# EAGLE design RFM69%20USB%20Gateway (EAGLE 7.6.0)
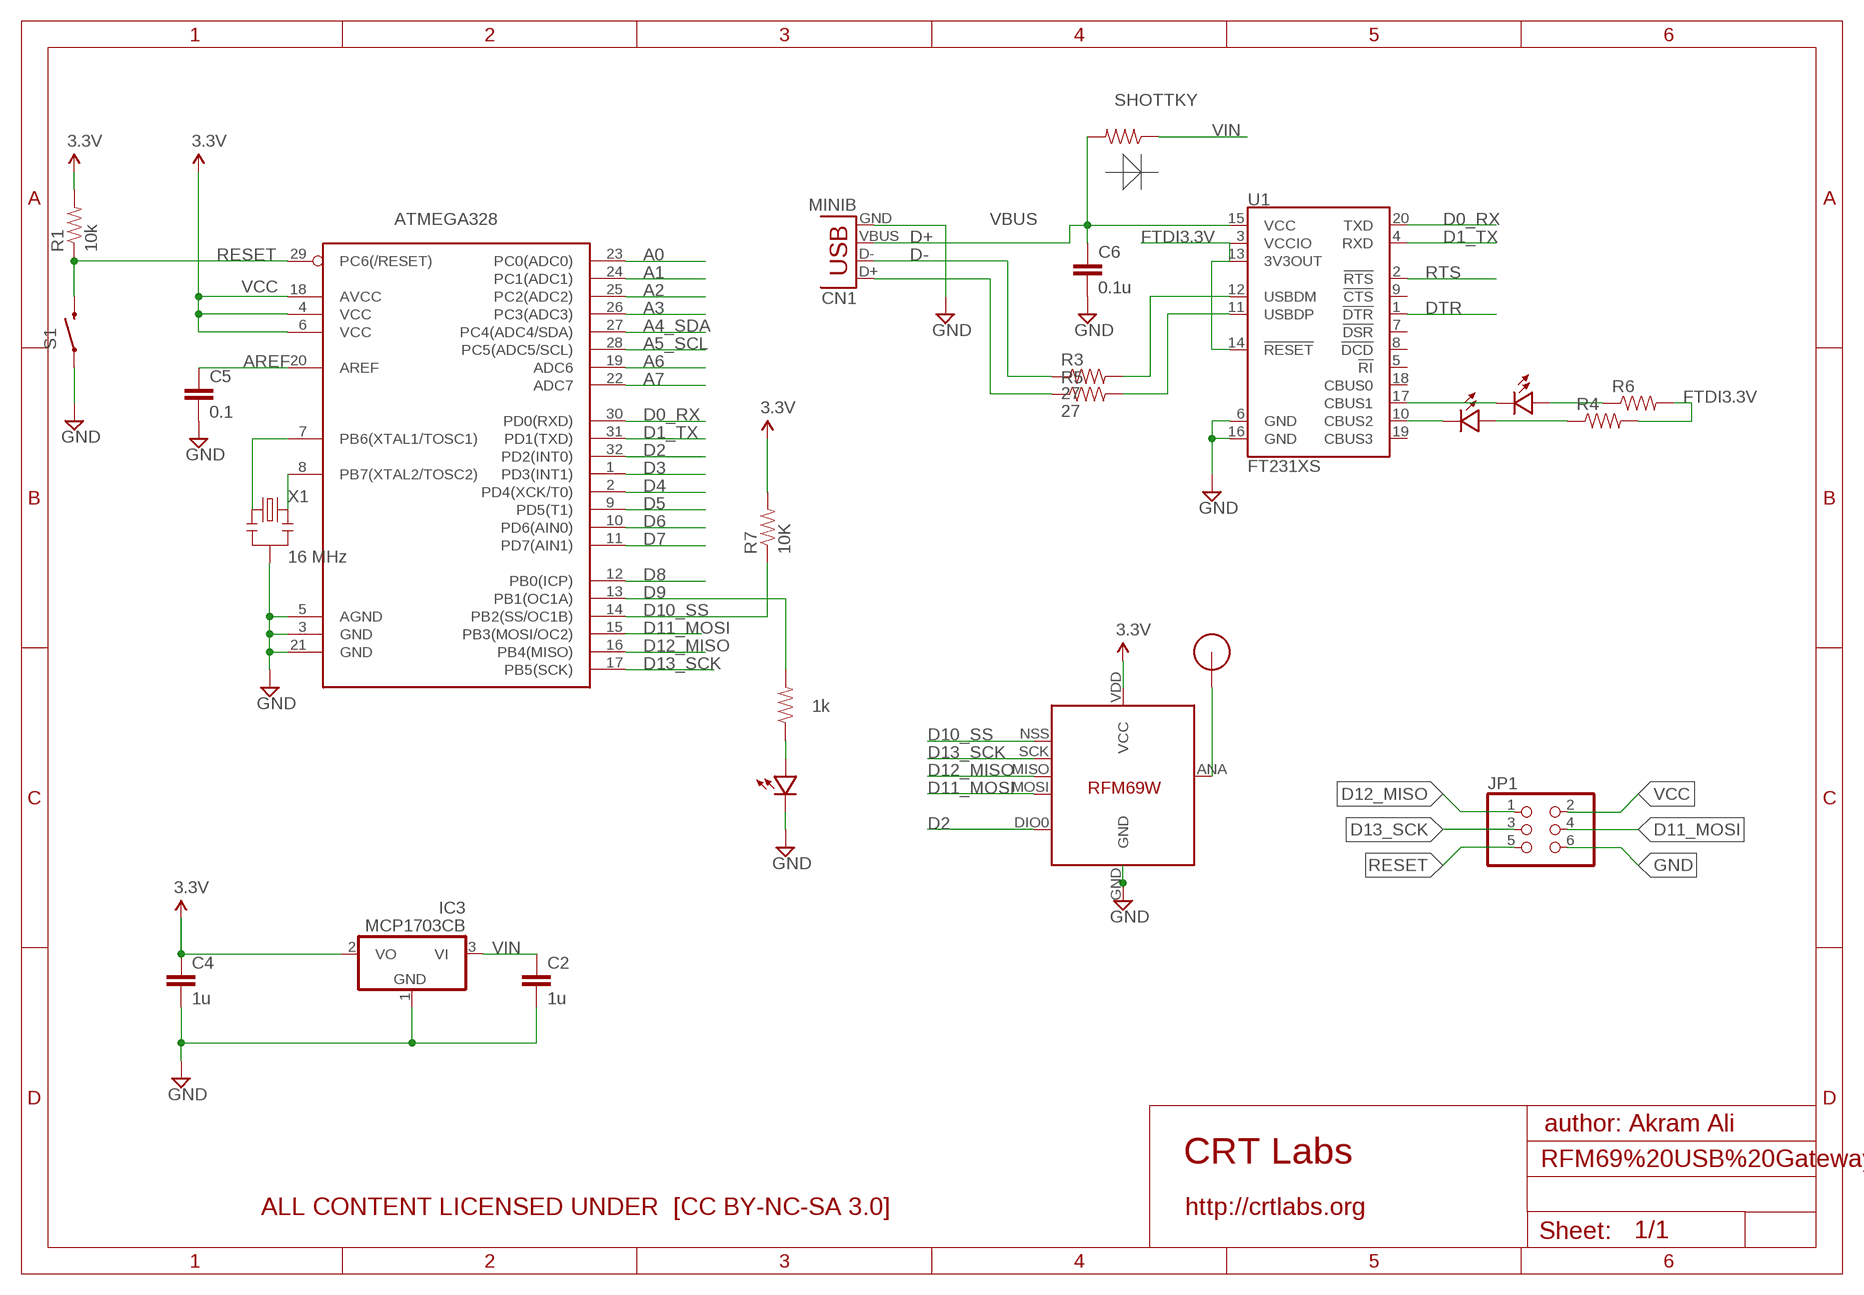
[diagram p0: schematic, sheet 1]

## Parts
ATMEGA328  ATMega-328  ATMEGA168/328TQFP32  [TQFP32-08]
C2  1u  CAP0805  [0805]
C4  1u  CAP0805  [0805]
C5  0.1  CAP0805  [0805]
C6  0.1u  CAP0805  [0805]
CN1  MINIB  USB-A-H  [USB-A-H]
D  SHOTTKY  RESISTOR0805  [0805]
IC3  MCP1703CB  [SOT23]
JP1  PINHD-2X3  [2X03]
R1  10k  RESISTOR0805  [0805]
R2  1k  RESISTOR0805-RES  [0805]
R3  27  RESISTOR0805-RES  [0805]
R4  RESISTOR0805-RES  [0805]
R5  27  RESISTOR0805-RES  [0805]
R6  RESISTOR0805-RES  [0805]
R7  10K  RESISTOR0805-RES  [0805]
S1  SWITCH-MOMENTARY-2SMD-ALT01  [TACTILE-SWITCH-SMD-ALT01]
U1  FT231XS  [SSOP20_L]
U$1  RFM12B_ANTENNA  [RFM12B-ANTENNA]
U$2  LED0805  [0805-LED]
U$4  LED0805  [0805-LED]
U$5  RFM69  [RFM69W-MINPADS]
U$7  LED0805  [0805-LED]
X1  16 MHz  RESONATORSMD  [RESONATOR-SMD]

## Nets
A0: ATMEGA328.23(PC0(ADC0))
A1: ATMEGA328.24(PC1(ADC1))
A2: ATMEGA328.25(PC2(ADC2))
A3: ATMEGA328.26(PC3(ADC3))
A4_SDA: ATMEGA328.27(PC4(ADC4/SDA))
A5_SCL: ATMEGA328.28(PC5(ADC5/SCL))
A6: ATMEGA328.19(ADC6)
A7: ATMEGA328.22(ADC7)
AREF: ATMEGA328.20(AREF) C5.1
D0_RX: ATMEGA328.30(PD0(RXD)) U1.20(TXD)
D1_TX: ATMEGA328.31(PD1(TXD)) U1.4(RXD)
D2: ATMEGA328.32(PD2(INT0)) U$5.DIO0
D3: ATMEGA328.1(PD3(INT1))
D4: ATMEGA328.2(PD4(XCK/T0))
D5: ATMEGA328.9(PD5(T1))
D6: ATMEGA328.10(PD6(AIN0))
D7: ATMEGA328.11(PD7(AIN1))
D8: ATMEGA328.12(PB0(ICP))
D9: ATMEGA328.13(PB1(OC1A)) R2.2
D10_SS: ATMEGA328.14(PB2(SS/OC1B)) R7.1 U$5.NSS(SEL)
D11_MOSI: ATMEGA328.15(PB3(MOSI/OC2)) JP1.4 U$5.MOSI
D12_MISO: ATMEGA328.16(PB4(MISO)) JP1.1 U$5.MISO
D13_SCK: ATMEGA328.17(PB5(SCK)) JP1.3 U$5.SCK
D+: CN1.D+ R5.1
D-: CN1.D- R3.1
DTR: U1.1(!DTR)
FTDI3.3V: R4.2 R6.2 U1.3(VCCIO) U1.13(3V3OUT) U1.14(!RESET)
GND [power]: ATMEGA328.3(GND) ATMEGA328.5(AGND) ATMEGA328.21(GND) C2.2 C4.2 C5.2 C6.2 CN1.GND IC3.1(GND) JP1.6 S1.1 S1.2 U1.6(GND) U1.16(GND) U$2.MINUS U$5.GND X1.2
N$1: ATMEGA328.7(PB6(XTAL1/TOSC1)) X1.1
N$2: R2.1 U$2.PLUS
N$3: U$1.P$1 U$5.ANA(ANT)
N$4: R3.2 U1.12(USBDM)
N$5: R5.2 U1.11(USBDP)
N$6: U1.17(CBUS1) U$4.MINUS
N$7: U1.10(CBUS2) U$7.MINUS
N$8: R4.1 U$7.PLUS
N$9: R6.1 U$4.PLUS
N$21: ATMEGA328.8(PB7(XTAL2/TOSC2)) X1.3
RESET: ATMEGA328.29(PC6(/RESET)) JP1.5 R1.1 S1.3 S1.4
RTS: U1.2(!RTS)
VBUS [power]: C6.1 CN1.VBUS D.2 U1.15(VCC)
VCC: ATMEGA328.4(VCC) ATMEGA328.6(VCC) ATMEGA328.18(AVCC) C4.1 IC3.2(VO) JP1.2 R1.2 R7.2 U$5.VDD(VCC) ; supply symbol labelled 3.3V
VIN: C2.1 D.1 IC3.3(VI)
Unconnected: U1.5(!RI) U1.7(!DSR) U1.8(!DCD) U1.9(!CTS) U1.18(CBUS0) U1.19(CBUS3)

## Notes on the sheet
- author: Akram Ali
- CRT Labs
- ALL CONTENT LICENSED UNDER  [CC BY-NC-SA 3.0] | http://crtlabs.org

## Library data of the parts
ATMEGA328 = LowPowerLab:ATMEGA168/328: Atmel 32-pin 8-bit micro, 16k flash.
C2 C5 C6 = SparkFun:CAP: Capacitor Standard 0603 ceramic capacitor, and 0.1" leaded capacitor.
C4 = LowPowerLab:CAP: Capacitor Standard 0603 ceramic capacitor, and 0.1" leaded capacitor.
CN1 = SparkFun-Connectors:USB: USB Connectors USB-B-PTH is fully proven SKU : PRT-00139/CONN-08278 USB-miniB is fully proven SKU : PRT-00587 USB-A-PCB is untested. USB-A-H is throughly reviewed, but untested. Spark Fun Electronics SKU : PRT-00437 USB-B-SMT is throughly reviewed, but untested. Needs silkscreen touching up. USB-A-S has not been used/tested USB-MB-H has not been used/tested USB-MICROB has been used. CONN-09505; PROD_ID: CONN-08367
D R1 = LowPowerLab:RESISTOR: Resistor Basic schematic elements and footprints for 0603, 1206, and PTH resistors.
IC3 = linear:MCP1703: 250 mA, 16V, Low Quiescent Current LDO Regulator Source: http://ww1.microchip.com/downloads/en/DeviceDoc/22049b.pdf
JP1 = pinhead:PINHD-2X3: PIN HEADER
R2-R7 = SparkFun:RESISTOR: Resistor Basic schematic elements and footprints for 0603, 1206, and PTH resistors.
S1 = Testing:SWITCH-MOMENTARY-2: Various NO switches- pushbuttons, reed, etc
U1 = SparkFun-DigitalIC:FT231X: FTDI FT231X Full Speed USB to Full-handshake UART This USB2.0 Full Speed IC offers a compact bridge to full handshake UART interfaces. The device is a UART, capable of operating up to 3MBaud, with low power consumption (8mA). The FT231X includes the complete FT-X series feature set and enables USB to be added into a system design quickly and easily over a UART interface.; PROD_ID: IC-11524
U$1 = LowPowerLab:RFM12B_ANTENNA
U$2 U$4 U$7 = LowPowerLab:LED
U$5 = LowPowerLab:RFM69
X1 = SparkFun:RESONATOR: Resonator Small SMD resonator. This is the itty bitty 10/20MHz resonators with built in caps. CSTCE10M0G55 and CSTCE20M0V53. Footprint has been reviewed closely but hasn't been tested yet.

## Net classes
1 power: width 0.381 mm, clearance 0.254 mm

## Board
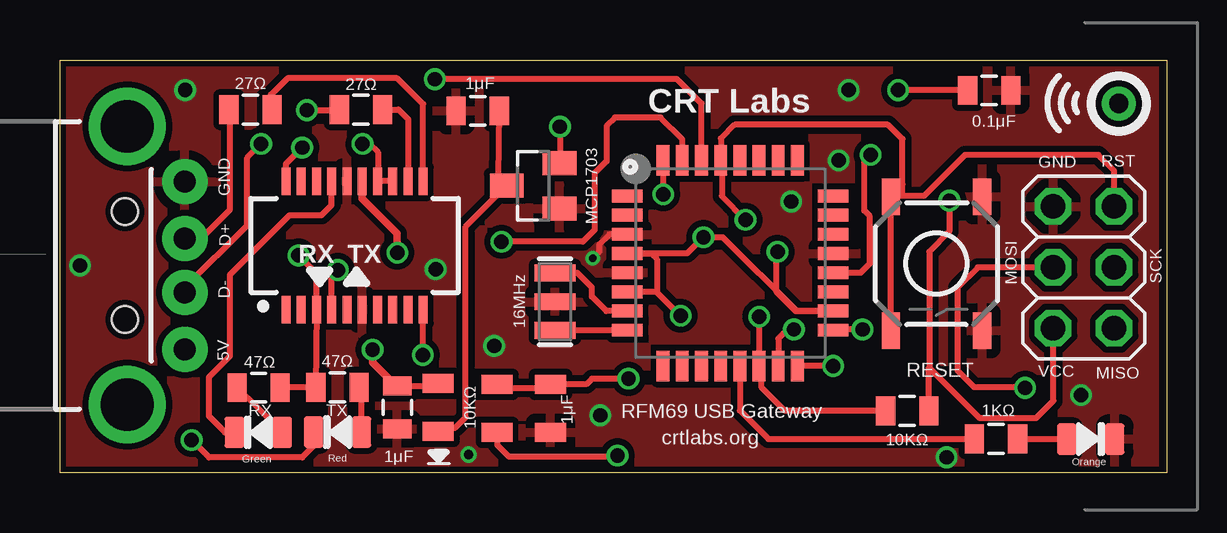
[diagram p1: board, top side]
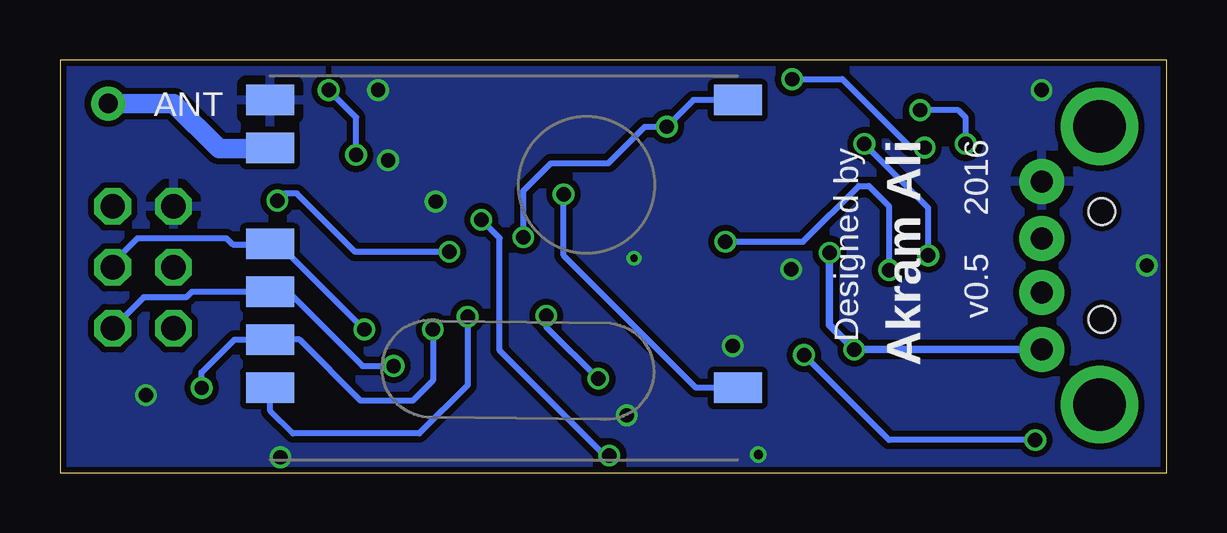
[diagram p2: board, bottom side, seen from below]

Size 46.14 x 17.22 mm. Coordinates in mm from the lower left corner, seen from the top.
Outline: 46.14,0 0,0 0,17.22 46.14,17.22 46.14,0
Copper layers (1*16): Top 0.035mm / dielectric 1.5mm / Bottom 0.035mm
Design rules "ITEADstudio_DRC *": minimum track width 6mil, minimum drill 12mil, track to track 6mil, track to pad 6mil, pad to pad 6mil, via to via 6mil, smd to smd 0mil, copper to edge 10mil, drill to drill 10mil, minimum pad ring 10mil, minimum via ring 6mil, stop-mask expansion 2mil, vias tented up to drill 100mil, thermal gap 15mil
tRestrict: area 6.5,12.3 to 7.4,12.8

### Footprints (pad centres in the part's own frame; a part is rotated, then mirrored left to right if it is on the bottom)
TQFP32-08 = smd 1.27 x 0.533: 1 -4.293,2.8; 2 -4.293,2; 3 -4.293,1.2; 4 -4.293,0.4; 5 -4.293,-0.4; 6 -4.293,-1.2; 7 -4.293,-2; 8 -4.293,-2.8; 17 4.293,-2.8; 18 4.293,-2; 19 4.293,-1.2; 20 4.293,-0.4; 21 4.293,0.4; 22 4.293,1.2; 23 4.293,2; 24 4.293,2.8 | smd 0.533 x 1.27: 9 -2.8,-4.293; 10 -2,-4.293; 11 -1.2,-4.293; 12 -0.4,-4.293; 13 0.4,-4.293; 14 1.2,-4.293; 15 2,-4.293; 16 2.8,-4.293; 25 2.8,4.293; 26 2,4.293; 27 1.2,4.293; 28 0.4,4.293; 29 -0.4,4.293; 30 -1.2,4.293; 31 -2,4.293; 32 -2.8,4.293
0805 = smd 0.8 x 1.2: 1 -0.9,0; 2 0.9,0
0805' = smd 0.8 x 1.3: 1 -1,0; 2 1,0
USB-A-H = drill 0.914 pad 1.88: D+ 2.4,1.127; D- 2.4,-1.127; GND 2.4,3.5; VBUS 2.4,-3.5 | drill 2.2: GND2 0,-5.8; GND3 0,5.8 | hole 1.1: -0.1,2.25; -0.1,-2.25
SOT23 = smd 1 x 1.4: 1 -0.95,-1.1; 2 0.95,-1.1; 3 0,1.1
2X03 = drill 1.016 octagon: 1 -2.54,-1.27; 2 -2.54,1.27; 3 0,-1.27; 4 0,1.27; 5 2.54,-1.27; 6 2.54,1.27
TACTILE-SWITCH-SMD-ALT01 = smd 1.524 x 0.762: 1 -2.794,1.905; 2 2.794,1.905; 3 -2.794,-1.905; 4 2.794,-1.905
SSOP20_L = smd 0.381 x 1.143: 1 -2.857,-2.68; 2 -2.223,-2.68; 3 -1.587,-2.68; 4 -0.953,-2.68; 5 -0.318,-2.68; 6 0.318,-2.68; 7 0.953,-2.68; 8 1.587,-2.68; 9 2.223,-2.68; 10 2.857,-2.68; 11 2.857,2.68; 12 2.223,2.68; 13 1.587,2.68; 14 0.953,2.68; 15 0.318,2.68; 16 -0.318,2.68; 17 -0.953,2.68; 18 -1.587,2.68; 19 -2.223,2.68; 20 -2.857,2.68
RFM12B-ANTENNA = drill 0.8 pad 1.422: P$1 0,0
0805-LED = smd 0.8 x 1.3: MINUS -1,0; PLUS 1,0
RFM69W-MINPADS = smd 2 x 1.27: ANA 8,-5; DIO0 -11.5,5; GND 8,-7; MISO 8,1; MOSI 8,3; NSS 8,5; SCK 8,-1; VDD -11.5,-7
RESONATOR-SMD = smd 0.7 x 1.7: 1 -1.2,0; 2 0,0; 3 1.2,0

### Placement (x,y rotation side)
ATMEGA328  27.94,8.75 0 top
C2  17.41,15.1 180 top
C4  1u  [0805']  20.45,2.69 270 top
C5  38.73,15.95 0 top
C6  14.06,2.73 270 top
CN1  2.81,8.65 0 top
D  SHOTTKY  [0805']  15.76,2.73 90 top
IC3  19.72,11.98 90 top
JP1  42.67,8.57 90 top
R1  10k  [0805']  18.22,2.69 90 top
R2  39.01,1.42 180 top
R3  12.55,15.15 0 top
R4  11.57,3.57 180 top
R5  7.94,15.15 0 top
R6  8.28,3.56 0 top
R7  35.32,2.59 0 top
S1  36.54,8.72 270 top
U1  12.28,9.49 0 top
U$1  44.13,15.41 0 top
U$2  42.96,1.41 180 top
U$4  8.27,1.69 0 top
U$5  29.39,8.55 180 bottom
U$7  11.57,1.7 0 top
X1  20.64,7.14 270 top

### Tracks (layer width: path | path; a pad name or v marks a point on that pad's centre or on a via)
AREF  (via drill 0.6 pad 0.3)
  Top 0.254: ATMEGA328.20 33.38,8.35 33.76,8.73 33.76,10.71 33.53,10.93 33.53,12.99 v33.8,13.26 | C5.1 34.95,15.95 v34.94,15.96
  Bottom 0.254: v34.94,15.96 33.8,14.82 v33.8,13.26
D0_RX  (via drill 0.6 pad 0.3)
  Top 0.254: U1.20 9.42,12.89 v10.1,13.56 | v15.62,16.42 25.72,16.42 26.74,15.4 ATMEGA328.30
  Bottom 0.254: v10.1,13.56 10.67,13.56 13.53,16.42 v15.62,16.42
D1_TX  (via drill 0.6 pad 0.3)
  Top 0.254: U1.4 11.33,8.2 v11.58,8.46 | ATMEGA328.31 25.94,13.91 25.03,14.82 23.13,14.82 22.78,14.48 22.78,12.99 22.29,12.5 22.29,10.13 21.79,9.64 v18.4,9.64
  Bottom 0.254: v18.4,9.64 15.16,9.64 12.84,11.96 12.42,11.96 11.58,11.13 v11.58,8.46
D2  (via drill 0.6 pad 0.3)
  Top 0.254: v25.15,11.62 ATMEGA328.32
  Bottom 0.254: 25.11,11.58 v25.15,11.62 25.15,9.07 19.63,3.55 U$5.DIO0
D9
  Top 0.254: ATMEGA328.13 28.34,2.6 29.53,1.41 38.15,1.41 R2.2
D10_SS  (via drill 0.6 pad 0.3)
  Top 0.254: v29.15,6.52 ATMEGA328.14 29.24,4.36 29.24,3.56 30.21,2.59 R7.1
  Bottom 0.254: v29.15,6.52 29.15,3.66 31.17,1.64 36.42,1.64 37.38,2.59 U$5.NSS
D11_MOSI  (via drill 0.6 pad 0.3)
  Top 0.254: v30.59,5.98 30.33,5.98 29.95,5.6 ATMEGA328.15 | JP1.4 38.25,8.57 37.41,7.73 37.41,4.27 38.1,3.58 40.2,3.58 v40.23,3.54
  Bottom 0.254: 30.56,5.94 v30.59,5.98 30.59,3.85 31.43,3.01 33.6,3.01 36.16,5.56 37.37,5.56 U$5.MOSI 37.4,5.56 38.86,5.56 40.23,4.19 v40.23,3.54
D12_MISO  (via drill 0.6 pad 0.3)
  Top 0.254: v32.23,4.46 ATMEGA328.16
  Bottom 0.254: v32.23,4.46 33.53,4.46 36.62,7.55 U$5.MISO 40.65,7.55 40.88,7.32 42.66,7.32 JP1.1
D13_SCK  (via drill 0.6 pad 0.3)
  Top 0.254: v33.45,5.98 32.26,5.98 ATMEGA328.17
  Bottom 0.254: JP1.3 43.94,8.75 42.9,9.79 39.21,9.79 38.94,9.53 37.41,9.53 U$5.SCK 37.02,9.55 v33.45,5.98
D+
  Top 0.254: CN1.D+ 5.89,9.78 7.09,10.97 7.09,15.15 R5.1
D-  (via drill 0.6 pad 0.3)
  Top 0.254: CN1.D- 5.21,7.72 7.81,10.33 7.81,13.14 v8.38,13.72 | v10.29,15.13 11.6,15.13 R3.1
  Bottom 0.254: v8.38,13.72 8.38,14.82 8.69,15.13 v10.29,15.13
FTDI3.3V  (via drill 0.6 pad 0.3)
  Top 0.254: U1.13 U1.14 13.26,12.19 13.26,13.37 12.92,13.72 v12.61,13.72 | v9.94,9.07 10.69,8.32 U1.3 10.72,6.78 R4.2 9.14,3.57 R6.2
  Bottom 0.254: v9.94,9.07 9.94,11.05 v12.61,13.72
GND  (via drill 0.3 pad 0.25, 0.38 pad 0.13, 0.6 pad 0.3)
  Top 0.254: ATMEGA328.3 22.9,9.95 22.48,9.53 22.48,9.22 v22.21,8.95
  other vias: 32.88,15.96 5.22,15.96 36.96,0.65 18.1,5.3 30.48,11.32 0.84,8.65 15.66,8.5 17.03,0.76 42.56,3.24 32.46,13.03 22.52,2.4
  pour Bottom: -1.1,21.07 -1.1,-3.7 46.09,-3.66 46.09,21.11
  pour Top: -0.42,21.03 -0.42,-3.73 45.63,-3.7 45.63,21.07
N$1
  Top 0.254: ATMEGA328.7 22.78,6.75 22.17,7.35 22.17,7.73 21.56,8.34 X1.1
N$2
  Top 0.254: R2.1 42.1,1.42 U$2.PLUS
N$3
  Bottom 0.813: U$1.P$1 41.39,15.41 39.51,13.53 37.41,13.53 U$5.ANA
N$4
  Top 0.254: R3.2 14.11,15.15 14.52,14.74 14.52,12.18 U1.12
N$5
  Top 0.254: U1.11 15.14,15.38 14.06,16.46 9.49,16.46 8.8,15.77 8.8,15.16 R5.2
N$6
  Top 0.254: U1.17 11.32,12.15 11.32,11.16 10.9,10.74 9.56,10.74 7.09,8.27 7.09,4.88 6.21,4 6.21,2.36 6.88,1.69 U$4.MINUS
N$7  (via drill 0.6 pad 0.3)
  Top 0.254: U$7.MINUS 10.72,1.27 10.1,0.65 6.21,0.65 v5.49,1.37 | v15.13,4.92 15.13,6.79 U1.10
  Bottom 0.254: v5.49,1.37 11.58,1.37 v15.13,4.92
N$8
  Top 0.254: U$7.PLUS 12.57,3.47 R4.1
N$9
  Top 0.254: U$4.PLUS 9.12,1.87 R6.1
N$21
  Top 0.254: ATMEGA328.8 20.65,5.95 X1.3
RESET  (via drill 0.6 pad 0.3)
  Top 0.254: R1.1 18.22,1.17 18.71,0.69 23.2,0.69 v23.24,0.72 | v28.58,10.55 27.58,11.54 27.58,13 ATMEGA328.29 27.55,13.94 28.12,14.52 34.52,14.52 35.12,13.92 35.12,12.04 | JP1.5 43.94,12.6 43.28,13.26 37.72,13.26 36,11.54 35.12,11.54 | 35.12,11.54 S1.3 S1.4 | 35.12,11.54 35.12,12.04 | 34.94,11.86 35.12,12.04
  Bottom 0.254: v23.24,0.72 23.43,0.72 27.81,5.11 27.81,9.79 v28.58,10.55
VBUS  (via drill 0.6 pad 0.3)
  Top 0.254: C6.1 15.71,3.63 D.2
  Top 0.305: U1.15 12.6,11.44 14.06,9.98 v14.06,9.18 | C6.1 14.06,3.58 13.03,4.61 v13.03,5.14
  Bottom 0.305: v14.06,9.18 14.06,6.17 v13.03,5.14 v13.03,5.15 CN1.VBUS
VCC  (via drill 0.6 pad 0.3)
  Top 0.254: v20.84,14.44 20.84,12.94 IC3.2 | 24.87,7.55 v25.87,6.55 | 19.99,3.54 C4.1 | 24.87,7.55 24.88,7.56 24.88,8.92 24.64,9.15 ATMEGA328.4 26.14,9.15 v26.82,9.83 27.62,9.83 30.71,6.74 ATMEGA328.18 30.66,6.75 29.87,7.54 29.87,9.18 v29.91,9.22 | 24.87,7.55 ATMEGA328.6 | R1.2 18.23,3.54 20.3,3.54 C4.1 | JP1.2 41.42,6.02 41.42,3.01 40.69,2.29 38.33,2.29 36.23,4.38 | v37.07,11.35 37.07,10.06 36.23,9.22 36.23,4.38 | R7.2 36.22,4.37 36.23,4.38 | v23.7,3.92 22.17,3.92 21.95,3.7 C4.1
  Bottom 0.254: v20.84,14.44 | v25.87,6.55 25.87,6.1 v23.7,3.92 | v26.82,9.83 26.82,11.77 25.68,12.92 23.28,12.92 21.76,14.44 v20.84,14.44 | U$5.VDD 19.73,15.55 v20.84,14.44 | v29.91,9.22 33.83,9.22 36.27,11.66 36.77,11.66 v37.07,11.35
VIN
  Top 0.254: C2.1 18.26,12.34 IC3.3 16.92,10.27 16.92,2.32 16.47,1.88 D.1

### Text on the board
tPlace: CRT Labs | RX | TX | RFM69 USB Gateway | crtlabs.org
bPlace: ANT | v0.5 2016 | Akram Ali | Designed by
tDocu: All dimensions in mils | Moteino-USB
_tsilk: 27Ω | 27Ω | 1μF | 0.1μF | GND | RST | GND | MCP1703 | D+ | SCK | MOSI | D- | 16MHz | 5V | 47Ω | 47Ω | RESET | VCC | MISO | RX | TX | 10KΩ | 1μF | 1KΩ | 1μF | 10KΩ | Green | Red | Orange